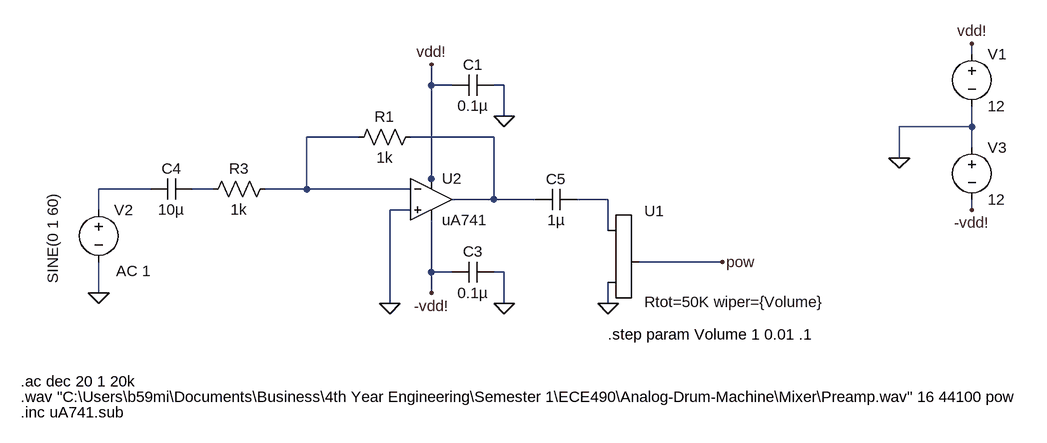
[diagram p0: schematic Input_Module.asc]
Input_Module.asc, the LTspice schematic file:
Version 4
SHEET 1 1912 796
WIRE 1024 -64 1024 -80
WIRE 192 -16 192 -48
WIRE 224 -16 192 -16
WIRE 304 -16 288 -16
WIRE 304 32 304 -16
WIRE 1024 48 1024 16
WIRE 1024 48 912 48
WIRE 80 64 0 64
WIRE 288 64 160 64
WIRE 1024 80 1024 48
WIRE 912 96 912 48
WIRE 192 128 192 -16
WIRE -240 144 -320 144
WIRE -144 144 -176 144
WIRE 0 144 0 64
WIRE 0 144 -64 144
WIRE 160 144 0 144
WIRE 192 144 192 128
WIRE 288 160 288 64
WIRE 288 160 224 160
WIRE 352 160 288 160
WIRE 464 160 416 160
WIRE -320 176 -320 144
WIRE 160 176 128 176
WIRE 1024 176 1024 160
WIRE 464 208 464 160
WIRE 640 256 512 256
WIRE 192 272 192 192
WIRE 224 272 192 272
WIRE 304 272 288 272
WIRE -320 304 -320 256
WIRE 192 304 192 272
WIRE 128 320 128 176
WIRE 304 320 304 272
WIRE 464 320 464 288
FLAG 128 320 0
FLAG 464 320 0
FLAG 304 32 0
FLAG 1024 -80 vdd!
FLAG 192 -48 vdd!
FLAG -320 304 0
FLAG 1024 176 -vdd!
FLAG 192 304 -vdd!
FLAG 304 320 0
FLAG 912 96 0
FLAG 640 256 pow
SYMBOL cap 288 -32 R90
WINDOW 0 0 32 VBottom 2
WINDOW 3 32 32 VTop 2
SYMATTR InstName C1
SYMATTR Value 0.1µ
SYMBOL res -48 128 R90
WINDOW 0 0 56 VBottom 2
WINDOW 3 32 56 VTop 2
SYMATTR InstName R3
SYMATTR Value 1k
SYMBOL voltage 1024 -80 R0
WINDOW 123 0 0 Left 0
WINDOW 39 0 0 Left 0
SYMATTR InstName V1
SYMATTR Value 12
SYMBOL voltage -320 160 R0
WINDOW 3 -71 -10 VRight 2
WINDOW 123 27 110 Left 2
SYMATTR Value SINE(0 1 60)
SYMATTR Value2 AC 1
SYMATTR InstName V2
SYMBOL voltage 1024 64 R0
WINDOW 123 0 0 Left 0
WINDOW 39 0 0 Left 0
SYMATTR InstName V3
SYMATTR Value 12
SYMBOL cap 288 256 R90
WINDOW 0 0 32 VBottom 2
WINDOW 3 32 32 VTop 2
SYMATTR InstName C3
SYMATTR Value 0.1µ
SYMBOL cap -176 128 R90
WINDOW 0 0 32 VBottom 2
WINDOW 3 32 32 VTop 2
SYMATTR InstName C4
SYMATTR Value 10µ
SYMBOL Opamps\\opamp2 192 96 R0
SYMATTR InstName U2
SYMATTR Value uA741
SYMBOL res 176 48 R90
WINDOW 0 0 56 VBottom 2
WINDOW 3 32 56 VTop 2
SYMATTR InstName R1
SYMATTR Value 1k
SYMBOL potentiometer_standard 448 192 R0
SYMATTR InstName U1
SYMATTR Value Rtot=50K wiper={Volume}
SYMATTR SpiceLine ""
SYMBOL cap 416 144 R90
WINDOW 0 0 32 VBottom 2
WINDOW 3 32 32 VTop 2
SYMATTR InstName C5
SYMATTR Value 1µ
TEXT -440 464 Left 2 !.wav "C:\\Users\\b59mi\\Documents\\Business\\4th Year Engineering\\Semester 1\\ECE490\\Analog-Drum-Machine\\Mixer\\Preamp.wav" 16 44100 pow
TEXT -440 488 Left 2 !.inc uA741.sub
TEXT -440 440 Left 2 !.ac dec 20 1 20k
TEXT 464 368 Left 2 !.step param Volume 1 0.01 .1

The netlist it stands for:
* Input_Module.asc
C1 0 vdd! 0.1µ
R3 N001 N004 1k
V1 vdd! 0 12
V2 N003 0 SINE(0 1 60) AC 1
V3 0 -vdd! 12
C3 0 -vdd! 0.1µ
C4 N004 N003 10µ
XU2 0 N001 vdd! -vdd! N002 uA741  ; pins In+ In- V+ V- OUT
R1 N002 N001 1k
XU1 N005 0 pow Rtot=50K wiper={Volume}
C5 N005 N002 1µ
.wav "C:\Users\b59mi\Documents\Business\4th Year Engineering\Semester 1\ECE490\Analog-Drum-Machine\Mixer\Preamp.wav" 16 44100 pow
.inc uA741.sub
.ac dec 20 1 20k
.step param Volume 1 0.01 .1
.backanno
.end